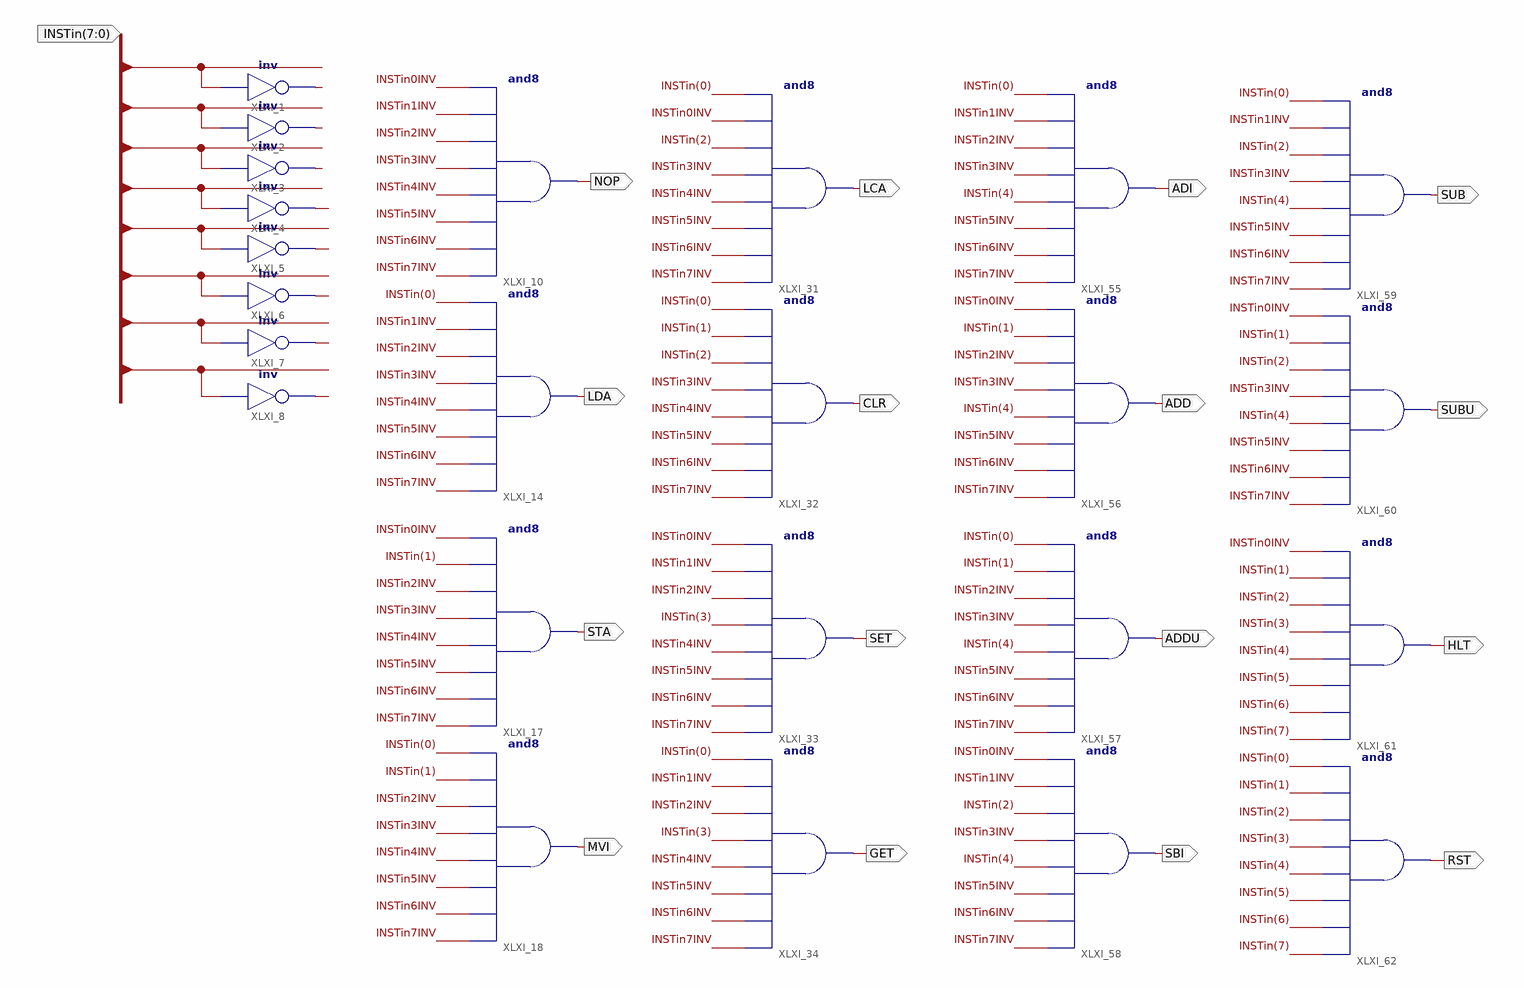
[diagram p0: schematic sheet 1]
// Xilinx ISE schematic Signals.sch (spartan3e) as structural Verilog: 24 symbols, 17 ports
module Signals (
  input  [7:0] INSTin,
  output MVI,
  output STA,
  output LDA,
  output NOP,
  output GET,
  output SET,
  output CLR,
  output LCA,
  output SBI,
  output ADDU,
  output ADD,
  output ADI,
  output RST,
  output HLT,
  output SUBU,
  output SUB
);

  wire INSTin0INV, INSTin1INV, INSTin2INV, INSTin3INV, INSTin4INV, INSTin5INV, INSTin6INV, INSTin7INV;

  not XLXI_1 (INSTin0INV, INSTin[0]);
  not XLXI_2 (INSTin1INV, INSTin[1]);
  not XLXI_4 (INSTin3INV, INSTin[3]);
  not XLXI_3 (INSTin2INV, INSTin[2]);
  not XLXI_5 (INSTin4INV, INSTin[4]);
  not XLXI_6 (INSTin5INV, INSTin[5]);
  not XLXI_7 (INSTin6INV, INSTin[6]);
  not XLXI_8 (INSTin7INV, INSTin[7]);
  and XLXI_10 (NOP, INSTin7INV, INSTin6INV, INSTin5INV, INSTin4INV, INSTin3INV, INSTin2INV, INSTin1INV, INSTin0INV);
  and XLXI_14 (LDA, INSTin7INV, INSTin6INV, INSTin5INV, INSTin4INV, INSTin3INV, INSTin2INV, INSTin1INV, INSTin[0]);
  and XLXI_17 (STA, INSTin7INV, INSTin6INV, INSTin5INV, INSTin4INV, INSTin3INV, INSTin2INV, INSTin[1], INSTin0INV);
  and XLXI_18 (MVI, INSTin7INV, INSTin6INV, INSTin5INV, INSTin4INV, INSTin3INV, INSTin2INV, INSTin[1], INSTin[0]);
  and XLXI_31 (LCA, INSTin7INV, INSTin6INV, INSTin5INV, INSTin4INV, INSTin3INV, INSTin[2], INSTin0INV, INSTin[0]);
  and XLXI_32 (CLR, INSTin7INV, INSTin6INV, INSTin5INV, INSTin4INV, INSTin3INV, INSTin[2], INSTin[1], INSTin[0]);
  and XLXI_33 (SET, INSTin7INV, INSTin6INV, INSTin5INV, INSTin4INV, INSTin[3], INSTin2INV, INSTin1INV, INSTin0INV);
  and XLXI_34 (GET, INSTin7INV, INSTin6INV, INSTin5INV, INSTin4INV, INSTin[3], INSTin2INV, INSTin1INV, INSTin[0]);
  and XLXI_55 (ADI, INSTin7INV, INSTin6INV, INSTin5INV, INSTin[4], INSTin3INV, INSTin2INV, INSTin1INV, INSTin[0]);
  and XLXI_56 (ADD, INSTin7INV, INSTin6INV, INSTin5INV, INSTin[4], INSTin3INV, INSTin2INV, INSTin[1], INSTin0INV);
  and XLXI_57 (ADDU, INSTin7INV, INSTin6INV, INSTin5INV, INSTin[4], INSTin3INV, INSTin2INV, INSTin[1], INSTin[0]);
  and XLXI_58 (SBI, INSTin7INV, INSTin6INV, INSTin5INV, INSTin[4], INSTin3INV, INSTin[2], INSTin1INV, INSTin0INV);
  and XLXI_59 (SUB, INSTin7INV, INSTin6INV, INSTin5INV, INSTin[4], INSTin3INV, INSTin[2], INSTin1INV, INSTin[0]);
  and XLXI_60 (SUBU, INSTin7INV, INSTin6INV, INSTin5INV, INSTin[4], INSTin3INV, INSTin[2], INSTin[1], INSTin0INV);
  and XLXI_61 (HLT, INSTin[7], INSTin[6], INSTin[5], INSTin[4], INSTin[3], INSTin[2], INSTin[1], INSTin0INV);
  and XLXI_62 (RST, INSTin[7], INSTin[6], INSTin[5], INSTin[4], INSTin[3], INSTin[2], INSTin[1], INSTin[0]);
endmodule
